# EAGLE board ECUTeen3.5_rev.A_20180306 (EAGLE 7.5.0)
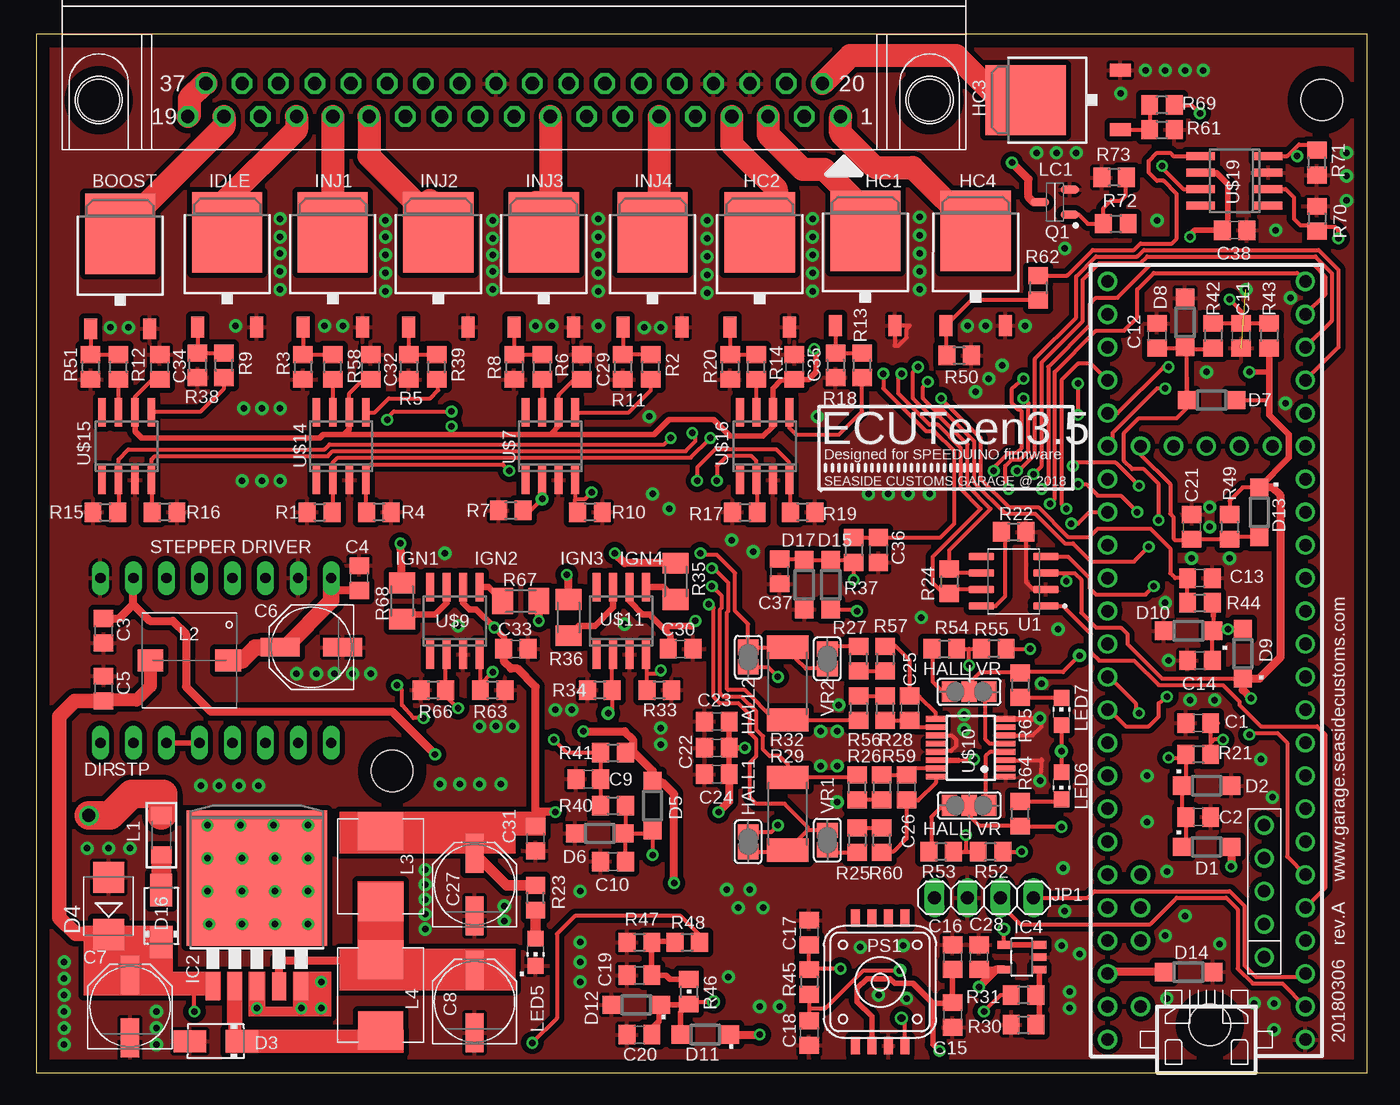
[diagram p2: board, top side]
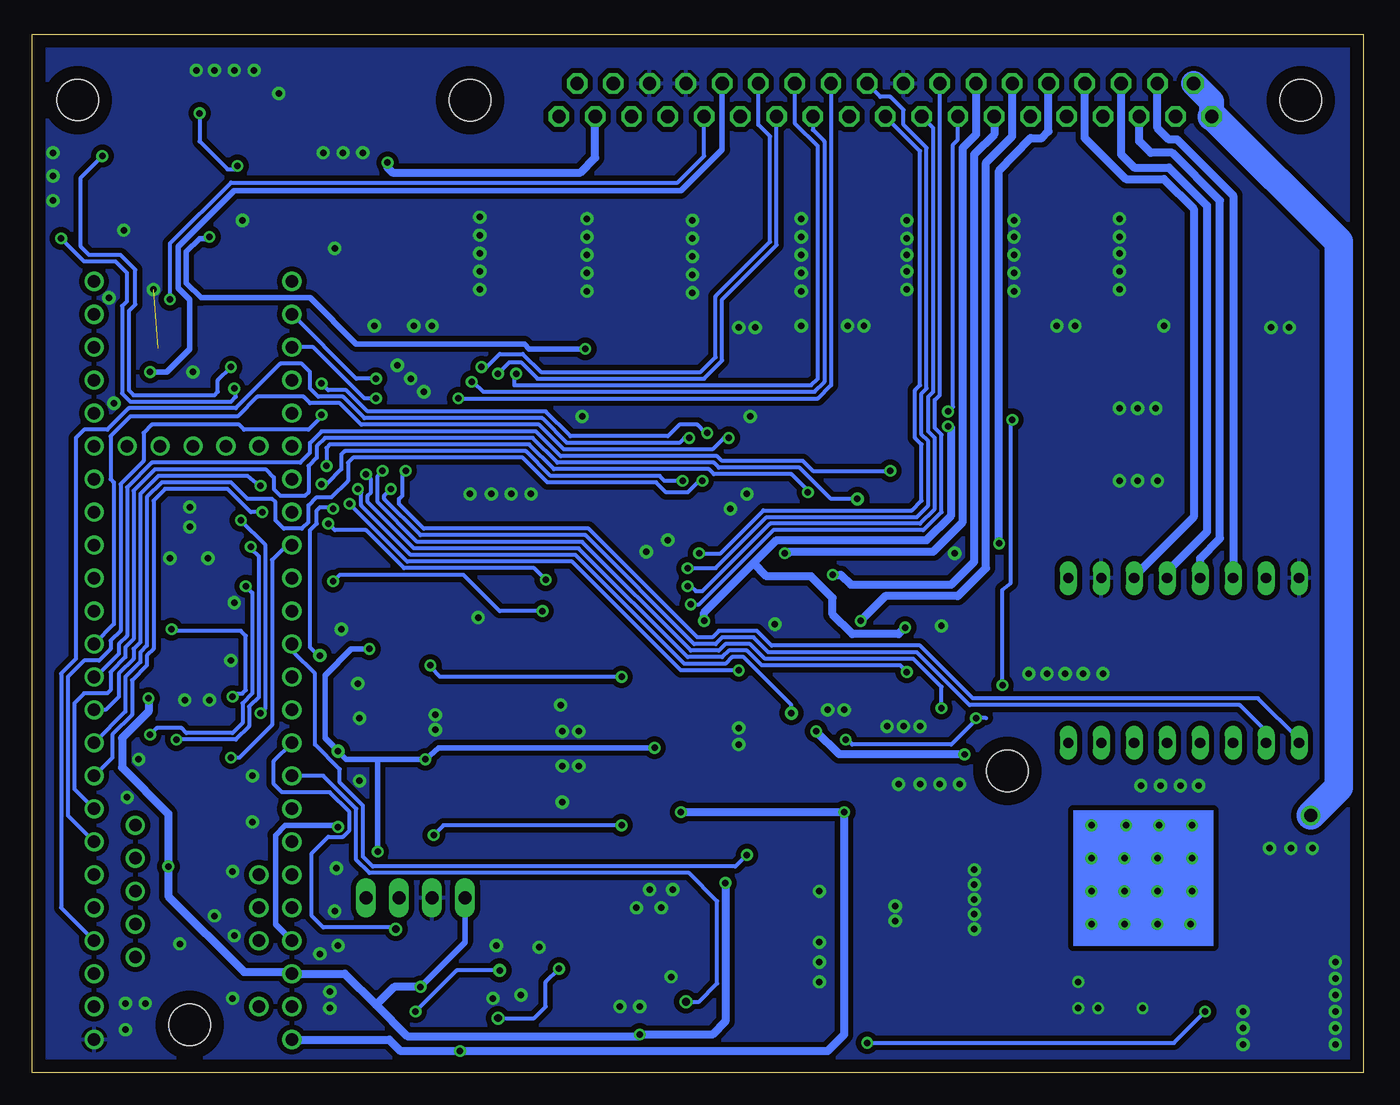
[diagram p3: board, bottom side, seen from below]

Size 102.54 x 80 mm. Coordinates in mm from the lower left corner, seen from the top.
Outline: 0,0 102.54,0 102.54,80 0,80 0,0
Copper layers (1*16): Top 0.035mm / dielectric 1.5mm / Bottom 0.035mm
Design rules "default *": minimum track width 10mil, minimum drill 24mil, track to track 8mil, track to pad 8mil, pad to pad 8mil, via to via 8mil, smd to smd 8mil, copper to edge 40mil, drill to drill 8mil, minimum pad ring 10mil, minimum via ring 8mil, stop-mask expansion 4mil, vias tented up to drill 20mil, thermal gap 10mil
Holes 3.2 mm at 27.43,23.24 90.42,3.68 99.06,74.93

## Footprints (pad centres in the part's own frame; a part is rotated, then mirrored left to right if it is on the bottom)
C0805 = smd 1.3 x 1.5: 1 -0.95,0; 2 0.95,0
PANASONIC_D = smd 3 x 1.4: + 2.4,0; - -2.4,0
D-37M/90 = drill 1.016 pad 1.575 octagon: 1 25.146,-1.27; 2 22.352,-1.27; 3 19.558,-1.27; 4 16.764,-1.27; 5 13.97,-1.27; 6 11.176,-1.27; 7 8.382,-1.27; 8 5.588,-1.27; 9 2.794,-1.27; 10 0,-1.27; 11 -2.794,-1.27; 12 -5.588,-1.27; 13 -8.382,-1.27; 14 -11.176,-1.27; 15 -13.97,-1.27; 16 -16.764,-1.27; 17 -19.558,-1.27; 18 -22.352,-1.27; 19 -25.146,-1.27; 20 23.749,1.27; 21 20.955,1.27; 22 18.161,1.27; 23 15.367,1.27; 24 12.573,1.27; 25 9.779,1.27; 26 6.985,1.27; 27 4.191,1.27; 28 1.397,1.27; 29 -1.397,1.27; 30 -4.191,1.27; 31 -6.985,1.27; 32 -9.779,1.27; 33 -12.573,1.27; 34 -15.367,1.27; 35 -18.161,1.27; 36 -20.955,1.27; 37 -23.749,1.27 | hole 3.2: 32.004,0; -32.004,0
SOD123 = smd 1.4 x 1.4: A 1.9,0; C -1.9,0
DO214AC = smd 2.5 x 1.7: A 2,0; C -2,0
SMB = smd 2.4 x 2.4: A 2.2,0; C -2.2,0
TO263-5 = smd 1.067 x 2.159: 1 -3.404,-5.791; 2 -1.702,-5.791; 3 0,-5.791; 4 1.702,-5.791; 5 3.404,-5.791 | smd 10.8 x 10.41: 6 0,2.54
SOT23-5 = smd 0.6 x 1.05: 1 -0.95,-1.35; 2 0,-1.35; 3 0.95,-1.35; 4 0.95,1.35; 5 -0.95,1.35
SJ_2 = smd 1.168 x 1.6: 1 -1.524,0; 2 0,0; 3 1.524,0
1X04 = drill 1.016 long: 1 -3.81,0; 2 -1.27,0; 3 1.27,0; 4 3.81,0
L1206 = smd 1.3 x 1.6: 1 -1.524,0; 2 1.524,0
WE-PD_7332/7345_PLASTIC_BASE = smd 1.7 x 2: 1 0,3; 2 0,-3
WE-LHMI_7030/7050 = smd 2.95 x 3.5: 1 -2.725,0; 2 2.725,0
CHIP-LED0805 = smd 1.2 x 1.2: A 0,-1.05; C 0,1.05
1317A = smd 1.346 x 0.686: 1 4.915,-1.905; 2 4.915,-0.635; 3 4.915,0.635; 4 4.915,1.905; 5 -4.915,1.905; 6 -4.915,0.635; 7 -4.915,-0.635; 8 -4.915,-1.905
SOT95P280X135-3N = smd 1.4 x 0.65: 1 -1.15,0.95; 2 -1.15,-0.95; 3 1.15,0
R0805 = smd 1.3 x 1.5: 1 -0.95,0; 2 0.95,0
R2512 = smd 1.8 x 3.2: 1 -2.8,0; 2 2.8,0
M1206 = smd 1.6 x 2: 1 -1.4,0; 2 1.4,0
SJ = smd 1.168 x 1.6: 1 -0.762,0; 2 0.762,0
STEP-STICK = drill 0.8 long: 1A -8.89,-7.62; 1B -8.89,-5.08; 2A -8.89,-2.54; 2B -8.89,0; DIR 3.81,-12.7; EN 3.81,5.08; GND -8.89,-12.7; GNDM -8.89,2.54; MS1 3.81,2.54; MS2 3.81,0; MS3 3.81,-2.54; RST 3.81,-5.08; SLP 3.81,-7.62; SPT 3.81,-10.16; VCC -8.89,-10.16; VMOT -8.89,5.08
SOIC127P600X175-8N = smd 1.97 x 0.6: 1 -2.475,1.905; 2 -2.475,0.635; 3 -2.475,-0.635; 4 -2.475,-1.905; 5 2.475,-1.905; 6 2.475,-0.635; 7 2.475,0.635; 8 2.475,1.905
TEENSY_3.5/3.6 = drill 0.965: 0/RX -25.4,-7.62; 1/TX -22.86,-7.62; 2 -20.32,-7.62; 3/CANTX -17.78,-7.62; 3V3 7.62,-7.62; 3V3_2 17.78,-2.54; 3V3_LO -22.86,7.62; 4/CANRX -15.24,-7.62; 5 -12.7,-7.62; 6 -10.16,-7.62; 7 -7.62,-7.62; 8 -5.08,-7.62; 9/CS -2.54,-7.62; 10/CS 0,-7.62; 11/MOSI 2.54,-7.62; 12/MISO 5.08,-7.62; 13/SCK 5.08,7.62; 14/A0 2.54,7.62; 15/A1 0,7.62; 16/A2 -2.54,7.62; 17/A3 -5.08,7.62; 18/A4/SDA -7.62,7.62; 19/A5/SCL -10.16,7.62; 20/A6 -12.7,7.62; 21/A7 -15.24,7.62; 21/DAC0 12.7,7.62; 22/A8 -17.78,7.62; 23/A9 -20.32,7.62; 24 10.16,-7.62; 25 12.7,-7.62; 26 15.24,-7.62; 27 17.78,-7.62; 28 20.32,-7.62; 29 22.86,-7.62; 30 25.4,-7.62; 31/A12 27.94,-7.62; 32/A13 30.48,-7.62; 33/A14 30.48,7.62; 34/A15 27.94,7.62; 35/A16 25.4,7.62; 36/A17 22.86,7.62; 37/A18 20.32,7.62; 38/A19 17.78,7.62; 39/A20 15.24,7.62; A10 -17.78,5.08; A11 -15.24,5.08; A22/DAC1 10.16,7.62; AGND -25.4,7.62; AREF -20.32,5.08; GND -27.94,-7.62; GND2 7.62,7.62; GND3 17.78,0; PROG 17.78,2.54; RESET 17.78,5.08; U5V -21.59,-4.445; UD+ -16.51,-4.445; UD- -19.05,-4.445; UGND1 -13.97,-4.445; UGND2 -11.43,-4.445; VBAT 17.78,-5.08; VIN -27.94,7.62; VUSB -25.4,5.08
DPAK_N-CHANNEL_MOSFET = smd 5.4 x 6.2: D 0,1.23 | smd 1 x 1.6: G -2.28,-6.07; S 2.28,-6.07
SO-8 = smd 0.6 x 2.2: 1 -1.905,-2.6; 2 -0.635,-2.6; 3 0.635,-2.6; 4 1.905,-2.6; 5 1.905,2.6; 6 0.635,2.6; 7 -0.635,2.6; 8 -1.905,2.6
QSOP16 = smd 0.45 x 1.5: 1 -2.223,-2.69; 2 -1.587,-2.69; 3 -0.953,-2.69; 4 -0.318,-2.69; 5 0.318,-2.69; 6 0.953,-2.69; 7 1.587,-2.69; 8 2.223,-2.69; 9 2.223,2.69; 10 1.587,2.69; 11 0.953,2.69; 12 0.318,2.69; 13 -0.318,2.69; 14 -0.953,2.69; 15 -1.587,2.69; 16 -2.223,2.69

## Placement (x,y rotation side)
C1  100nF  [C0805]  89.53,26.92 180 top
C2  220nF  [C0805]  89.53,19.68 0 top
C3  100nF  [C0805]  5.21,34.04 270 top
C4  100nF 50V  [C0805]  24.89,38.1 90 top
C5  100nF 50V  [C0805]  5.21,29.59 90 top
C6  100uF 35V  [PANASONIC_D]  21.21,32.77 180 top
C7  470uF 50V  [PANASONIC_D]  7.24,5.08 90 top
C8  220uF 15V  [PANASONIC_D]  33.78,5.46 90 top
C9  100nF  [C0805]  42.55,22.61 180 top
C10  220nF  [C0805]  44.45,16.26 180 top
C11  100nF  [C0805]  92.84,56.77 270 top
C12  220nF  [C0805]  86.36,56.77 90 top
C13  100nF  [C0805]  89.66,38.1 0 top
C14  220nF  [C0805]  89.66,31.75 180 top
C15  1uF  [C0805]  70.61,4.45 270 top
C16  100nF  [C0805]  70.61,8.89 90 top
C17  100nF  [C0805]  59.56,10.79 270 top
C18  220nF  [C0805]  59.56,3.05 90 top
C19  100nF  [C0805]  46.48,7.49 180 top
C20  220nF  [C0805]  46.48,2.92 180 top
C21  4.7nF  [C0805]  89.03,42.04 90 top
C22  10nF  [C0805]  52.45,25.02 180 top
C23  100nF  [C0805]  52.45,27.05 180 top
C24  1uF  [C0805]  52.45,22.99 180 top
C25  1nF  [C0805]  67.31,28.07 90 top
C26  1nF  [C0805]  67.06,21.97 90 top
C27  220uF  [PANASONIC_D]  33.78,14.48 90 top
C28  100nF  [C0805]  72.64,8.89 270 top
C29  1uF  [C0805]  42.04,54.36 270 top
C30  1uF  [C0805]  49.66,32.64 180 top
C31  1uF  [C0805]  38.48,18.03 270 top
C32  1uF  [C0805]  25.78,54.36 270 top
C33  1uF  [C0805]  36.96,32.64 180 top
C34  1uF  [C0805]  9.53,54.36 270 top
C35  1uF  [C0805]  58.42,54.36 270 top
C36  100nF  [C0805]  64.9,40.26 270 top
C37  220nF  [C0805]  57.28,38.61 270 top
C38  1uF  [C0805]  92.33,64.9 180 top
CON1  [D-37M/90]  36.83,74.93 0 top
D1  1N5819HW-7-F  [SOD123]  90.17,17.4 180 top
D2  1N5819HW-7-F  [SOD123]  90.17,22.1 0 top
D3  B340A 3A  [DO214AC]  13.84,2.41 180 top
D4  1SMB5937BT3G  [SMB]  5.59,12.83 90 top
D5  1N5819HW-7-F  [SOD123]  47.5,20.57 270 top
D6  1N5819HW-7-F  [SOD123]  43.43,18.41 180 top
D7  1N5819HW-7-F  [SOD123]  90.55,51.82 180 top
D8  1N5819HW-7-F  [SOD123]  88.52,57.78 90 top
D9  1N5819HW-7-F  [SOD123]  92.96,32.26 90 top
D10  1N5819HW-7-F  [SOD123]  88.77,34.04 180 top
D11  1N5819  [SOD123]  51.56,2.92 180 top
D12  1N5819  [SOD123]  46.23,5.21 180 top
D13  1N5819HW-7-F  [SOD123]  94.23,43.18 270 top
D14  BZT52C3V6  [SOD123]  88.77,7.75 0 top
D15  1N5819HW-7-F  [SOD123]  61.21,37.59 90 top
D16  B340A 3A  [DO214AC]  9.65,12.06 90 top
D17  1N5819HW-7-F  [SOD123]  59.18,37.59 270 top
IC2  LM2596S  [TO263-5]  17.02,12.45 0 top
IC4  LMV321_SOT23-5DBV  [SOT23-5]  75.95,8.89 90 top
JMP1  [SJ_2]  71.88,20.57 180 top
JMP2  [SJ_2]  71.88,29.34 0 top
JP1  [1X04]  73.03,13.46 0 top
L1  600R 2A  [L1206]  9.65,18.29 90 top
L2  8.2uH 2.7A  [WE-PD_7332/7345_PLASTIC_BASE]  11.81,31.75 270 top
L3  33uH  [WE-LHMI_7030/7050]  26.54,15.88 90 top
L4  33uH  [WE-LHMI_7030/7050]  26.54,5.97 90 top
LED5  [CHIP-LED0805]  38.48,9.27 180 top
LED6  [CHIP-LED0805]  78.99,22.1 180 top
LED7  [CHIP-LED0805]  78.99,27.81 0 top
PS1  MPXH6400AC6T1  [1317A]  65.02,6.99 270 top
Q1  IRLML0030TRPBF  [SOT95P280X135-3N]  78.49,67.06 180 top
R1  100K  [R0805]  21.84,43.18 0 top
R2  22R  [R0805]  47.37,54.36 90 top
R3  68K  [R0805]  20.57,54.36 270 top
R4  100K  [R0805]  26.42,43.18 180 top
R5  68K  [R0805]  28.7,54.36 270 top
R6  22R  [R0805]  38.99,54.36 90 top
R7  100K  [R0805]  36.58,43.31 0 top
R8  68K  [R0805]  36.83,54.36 270 top
R9  22R  [R0805]  14.48,54.48 90 top
R10  100K  [R0805]  42.67,43.18 180 top
R11  68K  [R0805]  45.21,54.36 270 top
R12  22R  [R0805]  6.35,54.36 90 top
R13  22R  [R0805]  63.63,54.48 90 top
R14  22R  [R0805]  55.5,54.36 90 top
R15  100K  [R0805]  5.33,43.18 0 top
R16  100K  [R0805]  9.91,43.18 180 top
R17  100K  [R0805]  54.61,43.18 0 top
R18  68K  [R0805]  61.59,54.48 270 top
R19  100K  [R0805]  59.05,43.18 180 top
R20  68K  [R0805]  53.47,54.36 270 top
R21  470R  [R0805]  89.53,24.51 180 top
R22  10K  [R0805]  75.31,41.66 0 top
R23  1K  [R0805]  38.48,13.46 90 top
R24  120R  [R0805]  70.36,37.85 270 top
R25  5K  [R0805]  63.25,17.91 270 top
R26  5K  [R0805]  63.25,21.97 90 top
R27  5K  [R0805]  63.37,31.88 90 top
R28  5K  [R0805]  65.41,28.07 90 top
R29  4K7 3W  [R2512]  57.91,19.94 90 top
R30  330K 0.1%  [R0805]  76.07,3.68 0 top
R31  180K 0.1%  [R0805]  76.07,5.97 180 top
R32  4K7 3W  [R2512]  57.91,29.97 90 top
R33  100K  [R0805]  48.01,29.46 180 top
R34  100K  [R0805]  43.43,29.46 180 top
R35  22R  [M1206]  49.28,37.85 90 top
R36  22R  [M1206]  41.02,35.05 90 top
R37  470R  [R0805]  62.99,40.26 270 top
R38  68K  [R0805]  12.45,54.48 270 top
R39  22R  [R0805]  30.86,54.36 90 top
R40  470R  [R0805]  44.45,20.57 0 top
R41  2K49  [R0805]  44.45,24.64 0 top
R42  470R  [R0805]  90.68,56.77 270 top
R43  2K49  [R0805]  95,56.77 270 top
R44  470R  [R0805]  89.66,36.2 0 top
R45  470R  [R0805]  59.56,6.99 270 top
R46  470R  [R0805]  50.29,6.22 270 top
R47  1K  [R0805]  46.48,10.03 0 top
R48  3K9  [R0805]  50.16,10.03 0 top
R49  1K  [R0805]  91.95,42.04 270 top
R50  68K  [R0805]  71.12,55.24 0 top
R51  68K  [R0805]  4.19,54.36 270 top
R52  10K  [R0805]  73.53,17.02 180 top
R53  1K  [R0805]  69.72,17.02 180 top
R54  1K  [R0805]  69.98,32.64 0 top
R55  10K  [R0805]  73.79,32.64 180 top
R56  5K  [R0805]  63.37,28.07 270 top
R57  5K  [R0805]  65.41,31.88 270 top
R58  22R  [R0805]  22.86,54.36 90 top
R59  5K  [R0805]  65.15,21.97 270 top
R60  5K  [R0805]  65.15,17.91 90 top
R61  68K  [R0805]  86.74,72.64 0 top
R62  22R  [R0805]  77.22,60.45 270 top
R63  100K  [R0805]  35.18,29.46 180 top
R64  10K  [R0805]  75.82,19.94 90 top
R65  10K  [R0805]  75.82,29.84 270 top
R66  100K  [R0805]  30.61,29.46 180 top
R67  22R  [M1206]  37.34,36.32 0 top
R68  22R  [M1206]  28.19,36.32 90 top
R69  22R  [R0805]  86.74,74.55 180 top
R70  100K  [R0805]  98.68,65.79 270 top
R71  100K  [R0805]  98.68,70.1 90 top
R72  100R  [R0805]  83.19,65.41 0 top
R73  10K  [R0805]  83.06,68.96 180 top
SJ3  VR2  [SJ]  60.96,31.88 90 top
SJ4  VR1  [SJ]  60.96,17.91 270 top
SJ5  HALL2  [SJ]  54.86,32 270 top
SJ6  HALL1  [SJ]  54.86,17.78 90 top
STEPSTICK-X  STEP-STICK  [STEP-STICK]  17.65,29.21 270 top
U1  SN65HVD230QDR  [SOIC127P600X175-8N]  75.31,37.85 180 top
U$1  TEENSY_3.5/3.6  [TEENSY_3.5/3.6]  90.17,30.48 90 top
U$2  DPAK_N-CHANNEL_MOSFET  [DPAK_N-CHANNEL_MOSFET]  55.75,63.5 0 top
U$3  DPAK_N-CHANNEL_MOSFET  [DPAK_N-CHANNEL_MOSFET]  63.88,63.63 0 top
U$4  DPAK_N-CHANNEL_MOSFET  [DPAK_N-CHANNEL_MOSFET]  30.99,63.5 0 top
U$5  DPAK_N-CHANNEL_MOSFET  [DPAK_N-CHANNEL_MOSFET]  14.73,63.5 0 top
U$6  DPAK_N-CHANNEL_MOSFET  [DPAK_N-CHANNEL_MOSFET]  39.12,63.5 0 top
U$7  TC427SO-8  [SO-8]  39.62,48.26 0 top
U$8  DPAK_N-CHANNEL_MOSFET  [DPAK_N-CHANNEL_MOSFET]  47.5,63.5 0 top
U$9  TC427SO-8  [SO-8]  32.26,34.8 0 top
U$10  MAX9926  [QSOP16]  72.01,25.02 90 top
U$11  TC427SO-8  [SO-8]  45.09,34.8 0 top
U$12  DPAK_N-CHANNEL_MOSFET  [DPAK_N-CHANNEL_MOSFET]  22.86,63.5 0 top
U$13  DPAK_N-CHANNEL_MOSFET  [DPAK_N-CHANNEL_MOSFET]  6.48,63.37 0 top
U$14  TC427SO-8  [SO-8]  23.5,48.26 0 top
U$15  TC427SO-8  [SO-8]  6.99,48.26 0 top
U$16  TC427SO-8  [SO-8]  56.13,48.26 0 top
U$17  DPAK_N-CHANNEL_MOSFET  [DPAK_N-CHANNEL_MOSFET]  77.47,74.93 90 top
U$18  DPAK_N-CHANNEL_MOSFET  [DPAK_N-CHANNEL_MOSFET]  72.39,63.63 0 top
U$19  TC427SO-8  [SO-8]  92.33,68.71 90 top

## Tracks (layer width: path | path; a pad name or v marks a point on that pad's centre or on a via)
+3V3  (via drill 0.5)
  Top 0.305: D13.C 92.96,45.08 91.95,44.07 R49.1 | R43.2 95,55.12 | D7.C 94.87,51.82 95,51.94 | U1.3 79.12,38.48 | 79.12,38.48 80.01,38.48 80.52,37.97 80.52,35.43 81.66,34.29 83.57,34.29 84.07,33.78 84.07,33.02 86.74,30.35 D9.C | D15.C 63.11,35.69 v63.25,35.56 | v79.38,37.85 79.38,38.23 79.12,38.48
  Top 0.406: IC4.5 C28.2 | v93.47,53.98 95,53.98 95,53.72
  Top 0.508: R43.2 95,53.72 95,51.94 95,50.67 96.52,49.15 96.52,47.37 D13.C
  Top 0.61: C3.1 6.41,34.99 7.49,36.07 | 7.49,36.07 STEPSTICK-X.VCC | D11.C v55.75,2.92 | IC4.5 73.98,7.94 v72.64,6.6 | D14.C 82.68,7.75 U$1.3V3_LO | D13.C 95.25,45.09 95.89,44.45 95.89,32 94.24,30.36 D9.C 92.96,29.46 v93.6,28.83 | R41.2 46.1,24.64 | 46.1,24.64 47.5,23.24 D5.C 47.62,22.35 48.26,22.35 49.15,21.46 v49.15,14.61 | 7.49,36.07 8.76,34.8 10.54,34.8 11.56,33.78 11.56,29.72 13.46,27.81 27.43,27.81 v30.73,24.51 | v42.16,26.29 45.34,26.29 45.97,25.65 45.97,24.77 46.1,24.64 | D1.C v92.07,15.88 v92.08,15.88
  Bottom 0.305: v63.25,35.56 66.55,35.56 69.34,38.35 78.87,38.35 v79.38,37.85
  Bottom 0.406: v93.47,53.98 92.2,53.98 90.42,55.75 90.42,59.56 91.31,60.45 91.31,63.63 87,67.94 52.58,67.94 49.4,71.12 CON1.24 | JP1.1 69.22,10.03 v72.64,6.6
  Bottom 0.61: 76.07,5.21 78.49,7.62 U$1.3V3_LO 82.68,7.75 86.23,7.75 92.08,13.59 v92.08,15.88 92.08,19.94 95.63,23.5 95.63,25.78 93.6,27.81 v93.6,28.83 | 76.07,5.21 73.66,2.79 55.88,2.79 v55.75,2.92 50.16,2.92 49.15,3.94 v49.15,14.61 | v72.64,6.6 74.68,6.6 76.07,5.21 | v30.73,24.51 40.39,24.51 v42.16,26.29
+5V  (via drill 0.5, 0.5 pad 1.02)
  Top 0.305: U$7.6 40.26,52.2 41.4,53.34 41.97,53.34 C29.2 | U$15.6 7.62,52.07 8.89,53.34 9.46,53.34 C34.2 | U$14.6 24.13,52.32 25.02,53.21 25.59,53.21 C32.2 | 71.06,24.07 v72.26,24.13 | R55.1 v76.58,32.64 | R52.1 v75.95,17.02 | 70.55,5.33 C15.1 | LED7.A v78.99,24.77 LED6.A
  Top 0.406: 31.75,19.16 30.98,19.16 30.98,18.6 | U$10.14 71.06,24.07 | C24.1 C22.1 | C22.1 C23.1 | 69.08,5.33 70.55,5.33 | C16.1 C15.1 | 69.08,5.33 69.08,2.17 v69.6,1.65 | U$15.6 7.62,49.4 8.13,48.9 21.84,48.9 22.1,49.15 23.75,49.15 | 23.75,49.15 24.13,49.53 U$14.6 | 23.75,49.15 32,49.15 | 32,49.15 39.62,49.15 | 39.62,49.15 40.39,49.91 40.39,50.73 U$7.6 | 39.62,49.15 47.62,49.15 48.77,50.29 52.2,50.29 53.47,49.02 56.01,49.02 56.77,49.78 U$16.6 56.77,52.7 57.4,53.34 58.35,53.34 C35.2 59.5,53.41 60.07,53.98 60.07,55.63 v59.94,55.75 | C22.1 v54.61,25.02 | PS1.2 64.39,4.32 63.25,5.46 63.25,6.48 64.01,7.24 65.79,7.24 66.17,6.86 67.56,6.86 69.08,5.33 | v32,49.78 32,49.15 | U$19.6 90.93,69.34 91.82,68.45 91.82,65.34 C38.2 89.28,64.9 88.9,64.52 v88.9,64.39
  Top 0.508: 48.9,32.83 48.9,33.66 48.45,34.1 | 36.07,32.7 36.07,33.53 v35.31,34.29 33.91,35.69 33.4,35.69 32.89,36.2 U$9.6 | U$11.6 45.72,36.32 46.74,35.31 47.24,35.31 48.45,34.1 | 50.42,34.42 48.77,34.42 48.45,34.1
  Top 0.61: L3.2 30.98,18.6 | 31.75,19.16 32.37,18.47 | 32.37,18.47 C27.+ | 48.9,32.83 C30.2 | 36.07,32.7 C33.2 36.07,32.58 36.07,31.62 36.58,31.11 37.08,31.11 38.48,29.72 38.48,20.32 | 38.48,20.32 C31.1 32.88,18.98 32.37,18.47 | C24.1 53.4,20.89 v52.58,20.07 | v40.01,20.07 38.73,20.07 38.48,20.32 | 50.42,34.42 v50.8,34.8
  Top 0.813: R23.2 36.25,14.41 C27.+
  Bottom 0.305: 75.95,24 76.07,24.13
  Bottom 0.406: v75.95,17.02 75.95,24 | v54.61,25.02 71.25,25.02 v72.26,24.13 76.07,24.13 78.36,24.13 v78.99,24.77 80.01,25.78 80.01,30.61 77.98,32.64 v76.58,32.64 | v59.94,55.75 64.26,55.75 64.64,56.13 77.6,56.13 81.15,59.69 89.53,59.69 90.68,60.83 90.68,63.25 89.66,64.26 89.03,64.26 v88.9,64.39
  Bottom 0.61: v52.58,20.07 v40.01,20.07 40.01,2.92 41.27,1.65 v69.6,1.65 74.17,1.65 75.06,2.54 U$1.VIN | 46.99,39.24 50.8,35.43 v50.8,34.8 50.67,34.67 | 46.99,39.24 45.21,41.02 33.66,41.02 31.75,42.93 31.75,49.66 31.88,49.66 v32,49.78 | v35.31,34.29 35.81,33.78 39.37,33.78 40.89,35.31 40.89,36.58 42.55,38.23 45.97,38.23 46.99,39.24
+12V_ECU  (via drill 0.5)
  Top 0.305: IC2.1 12.06,6.66 | 12.06,6.66 10.41,6.66 | D4.C 7.24,8.98 C7.+ | R48.2 51.12,10.61 49.66,12.06 41.53,12.06 40.13,10.67 40.13,4.19 v38.23,2.29 | v12.19,4.7 12.19,6.53 12.06,6.66
  Top 1.016: L2.2 8.81,29.77 7.75,28.7 5.27,28.7 C5.1
  Top 1.118: C5.1 2.99,28.64 1.78,27.43 1.78,11.94 3.05,10.67 5.55,10.67 D4.C
  Top 1.27: C7.+ 7.24,6.66 10.41,6.66 9.65,7.42 D16.C
  Bottom 0.305: v38.23,2.29 14.61,2.29 v12.19,4.7
BOOST
  Top 1.676: 6.6,64.73 U$13.D
  Top 1.778: CON1.18 14.48,72.9 6.73,65.15 6.73,64.86 U$13.D
BOOST_CPU  (via drill 0.5)
  Top 0.305: R15.2 6.35,43.25 U$15.2 6.35,47.24 7.11,48.01 22.23,48.01 22.61,48.39 48.39,48.39 v48.9,48.9
  Bottom 0.305: U$1.11/MOSI 96.27,34.54 96.27,45.47 96.52,45.72 96.52,49.02 95,50.55 86.74,50.55 85.22,52.07 81.66,52.07 81.15,51.56 78.87,51.56 77.22,49.91 63.5,49.91 61.59,48.01 50.16,48.01 49.28,48.9 v48.9,48.9
BOOST_TC4
  Top 0.305: U$13.G R51.1 R12.2
BRV_CPU  (via drill 0.6)
  Top 0.305: 50.29,5.46 v52.2,5.46
  Top 0.406: R46.2 50.23,5.21 D12.C 48.01,5.08 48.01,3.94 47.43,3.36 C20.1 47.5,2.85 | R46.2 50.29,5.46 | D11.A 49.66,4.64 R46.2
  Bottom 0.305: v52.2,5.46 51.18,5.46 49.78,6.86 49.78,13.21 51.94,15.37 76.58,15.37 77.6,16.38 77.6,20.32 80.14,22.86 U$1.18/A4/SDA
CAM_CPU  (via drill 0.5, 0.5 pad 1.02)
  Top 0.305: JMP2.2 71.88,29.97 72.77,30.86 75.75,30.86 R65.1 75.89,30.86 79.12,30.86 v80.39,32.13 | U$1.36/A17 81.28,54.61 80.26,54.61 78.99,53.34 78.99,43.81 v79.38,43.43
  Bottom 0.305: v80.39,32.13 80.52,32.13 81.15,32.77 81.15,41.78 80.64,42.29 80.64,43.31 80.39,43.56 79.5,43.56 v79.38,43.43
CAN_H  (via drill 0.5)
  Top 0.305: U1.7 70.67,37.21 | 70.67,37.21 R24.2 | 70.67,37.21 69.6,37.21 69.09,37.72 69.09,39.75 72.77,43.43 71.25,44.96 71.25,48.13 69.47,49.91 68.83,49.91 66.42,52.32 66.42,53.59 v66.67,53.85
  Bottom 0.305: v66.67,53.85 65.79,54.74 64.9,54.74 63.63,53.47 50.8,53.47 49.4,54.86 49.4,59.56 45.21,63.75 CON1.7
CAN_L  (via drill 0.5)
  Top 0.305: U1.6 70.67,38.48 R24.1 70.36,40.26 73.53,43.43 71.75,45.21 71.75,48.39 69.6,50.55 68.96,50.55 67.56,51.94 67.56,53.98 v67.94,54.36
  Bottom 0.305: v67.94,54.36 67.56,54.36 66.55,55.37 64.77,55.37 63.37,53.98 51.05,53.98 49.91,55.12 49.91,59.82 45.72,64.01 45.72,72.14 46.61,73.03 CON1.25
CANRX  (via drill 0.5)
  Top 0.305: U1.4 79.5,39.75 81.15,38.1 81.15,37.34 81.66,36.83 85.47,36.83 v86.11,37.47 | v93.47,26.04 93.6,26.04 93.73,26.16 95.63,26.16 96.39,25.4 96.39,16.64 U$1.4/CANRX
  Bottom 0.305: v86.11,37.47 85.6,36.96 85.6,29.21 86.36,28.45 86.36,26.92 87.12,26.16 90.68,26.16 91.06,26.54 92.96,26.54 v93.47,26.04
CANTX
  Top 0.305: U1.1 79.12,35.94 81.28,33.78 81.28,32.38 81.92,31.75 84.58,31.75 86.49,29.84 91.44,29.84 92.71,28.57 92.71,28.32 94.36,26.67 98.68,26.67 99.31,26.04 99.31,14.22 U$1.3/CANTX
CLT_CPU  (via drill 0.5)
  Top 0.305: C12.1 88.45,55.82 D8.C 88.65,55.75 | 88.65,55.75 D7.A 88.65,53.59 88.65,51.18 87.88,50.42 84.96,50.42 83.82,49.28 83.82,47.12 84.45,46.48 85.34,46.48 86.49,45.34 v86.49,42.55 | 88.65,55.75 90.61,55.75 R42.2 | U$1.15/A1 82.68,30.48 84.71,28.45 84.71,27.94 v84.96,27.69
  Bottom 0.305: v86.49,42.55 84.58,40.64 84.58,28.07 v84.96,27.69
COOLANT_SENSOR  (via drill 0.5)
  Top 0.305: R43.1 C11.1 | C11.1 R42.1 | C11.1 92.84,58.67 v91.95,59.56
  Bottom 0.305: 91.82,59.69 v91.95,59.56 91.95,63.88 87.25,68.58 52.83,68.58 50.8,70.61 CON1.5
CRANK_CPU  (via drill 0.5)
  Top 0.305: JMP1.2 71.88,19.81 72.64,19.05 75.76,19.05 R64.1 75.89,18.92 v78.99,18.92
  Bottom 0.406: v78.99,18.92 79.12,18.92 79.25,19.05 83.06,19.05 83.82,18.29 83.82,11.43 U$1.23/A9
DIR  (via drill 0.5)
  Top 0.305: v73.79,46.35 73.79,46.61 74.93,47.75 75.56,47.75 75.95,48.13 75.95,50.93 75.82,51.05 75.69,51.05 75.18,51.56 75.18,52.7 v76.07,53.47
  Bottom 0.305: STEPSTICK-X.DIR 4.95,25.65 8.13,28.83 30.1,28.83 34.16,32.89 45.59,32.89 46.74,34.04 49.66,34.04 50.16,33.53 51.31,33.53 59.69,41.91 72.39,41.91 74.3,43.81 74.3,44.2 74.04,44.45 74.04,46.1 v73.79,46.35 | v76.07,53.47 77.6,53.47 U$1.34/A15
GND  (via drill 0.5 pad 0.61, 0.5 pad 1.02)  (1 unrouted)
  Top 0.305: v17.02,4.95 v20.45,4.95 v21.97,4.95 v21.97,6.99 | U$10.11 70.55,25.97 70.87,25.65 70.87,25.15 70.48,24.77 69.38,24.77 U$10.13 | U$10.6 76.77,25.97 77.47,26.67 v77.34,27.3 | U$10.3 77.41,24.07 77.47,24.13 v77.34,22.48 | R22.2 76.26,37.78 76.83,37.21 U1.2 | U$3.S 66.16,56.01 66.17,56.01 66.42,56.01 67.06,56.64 67.06,57.28 67.31,57.53 66.17,57.53 66.17,57.28 66.04,57.15
  Top 0.406: U$10.8 76.77,27.24 v77.34,27.3
  Top 0.813: IC2.5 20.42,4.98 v20.45,4.95 | IC2.3 v17.02,4.95
  other vias: 51.69,65.66 51.69,64.26 51.69,62.87 51.69,61.47 51.69,60.07 59.82,65.79 59.82,64.39 59.82,62.99 59.82,61.59 59.82,60.2 43.31,65.79 43.31,64.39 43.31,62.99 43.31,61.59 43.31,60.2 35.18,65.66 35.18,64.26 35.18,62.99 35.18,61.72 35.18,60.33 26.92,65.66 26.92,64.39 26.92,62.99 26.92,61.59 26.92,60.2 18.8,65.79 18.8,64.39 18.8,63.12 18.8,61.72 18.8,60.33 5.71,57.4 7.11,57.4 15.37,57.53 22.23,57.53 23.62,57.53 38.48,57.53 39.75,57.53 43.31,57.53 46.86,57.4 48.13,57.4 68.07,65.91 68.07,64.52 68.07,63.12 68.07,61.72 68.07,60.33 96.65,59.69 96.27,51.56 90.17,53.98 90.42,43.56 90.42,42.04 91.95,39.62 89.03,39.62 87,36.2 85.6,22.86 85.6,19.3 94.36,24.13 95.25,21.21 88.52,12.06 87.12,15.49 87,10.54 87.12,5.71 93.85,5.33 91.19,9.91 71.5,27.56 61.72,26.29 60.45,26.29 61.72,23.62 60.45,23.62 61.85,28.32 61.72,20.83 77.47,29.97 71.5,26.42 80.39,9.14 78.99,9.78 56.01,12.7 79.63,6.22 79.63,4.95 64.9,5.97 66.8,9.78 63.5,9.65 67.06,5.71 55.75,5.08 79.12,15.75 57.28,5.08 54.99,14.1 53.21,14.1 54.1,12.7 53.34,7.37 41.91,10.03 41.91,8.51 41.91,6.99 41.91,13.97 35.81,22.23 34.16,22.23 32.64,22.23 31.11,22.23 2.16,2.16 2.16,3.43 2.16,4.7 2.16,5.97 2.16,7.24 2.16,8.51 9.27,4.7 9.27,3.43 9.27,2.16 5.59,17.27 3.94,17.27 7.24,17.27 14.1,22.1 12.7,22.1 15.62,22.1 17.14,22.1 48.13,26.54 48.13,25.27 40.01,27.94 41.27,27.94 36.7,26.67 35.43,26.67 34.16,26.67 25.78,30.73 24.38,30.73 22.99,30.73 21.59,30.73 20.07,30.73 18.8,51.18 17.4,51.18 16,51.18 18.8,45.59 17.4,45.59 15.88,45.59 36.07,12.83 36.07,11.68 29.97,15.62 29.97,14.48 29.97,13.34 29.97,12.19 29.97,11.05 31.5,40.01 64.14,44.58 68.83,44.58 67.18,44.58 65.66,44.58 55.24,40.13 48.77,43.43 47.5,44.58 47.24,50.55 95.38,5.33 95.38,3.3 32.51,34.42 45.34,34.54 87.25,31.75 90.81,28.7 88.9,28.7 68.2,35.05 78.74,34.16 53.59,41.02 74.42,54.48 73.41,53.47 72.39,52.45 76.2,57.53 73.15,57.53 100.97,67.18 100.97,69.09 100.97,70.87 79.25,63.5 77.09,70.87 78.61,70.87 80.14,70.87 60.2,50.55 83.57,75.44 85.47,77.22 87,77.22 88.52,77.22 89.92,77.22 79.25,12.45 95.5,64.9 93.22,60.33 71.75,57.53 86.36,65.66
  pour Top (isolate 0.406): -1.52,80.14 102.87,80.01 102.87,0 -1.52,0.13
  pour Bottom (isolate 0.406): -1.27,81.28 104.14,81.28 104.14,-1.27 -1.27,-1.27
HC1
  Top 1.778: CON1.3 56.39,72.26 59.05,69.6 60.71,69.6 62.87,67.44 62.87,65.87 U$3.D
HC1_CPU  (via drill 0.5)
  Top 0.305: v50.93,45.59 50.93,46.61 52.32,48.01 57.02,48.01 58.04,46.99 U$16.4 58.1,45.59 R19.2
  Bottom 0.305: v50.93,45.59 51.18,45.59 52.07,44.7 53.72,44.7 54.48,45.47 62.87,45.47 64.77,47.37 77.85,47.37 78.23,46.99 78.23,45.59 79.5,44.32 80.64,44.32 81.28,43.69 81.28,42.42 81.79,41.91 83.19,41.91 83.82,42.55 83.82,43.94 84.07,44.2 85.98,44.2 87.25,45.47 92.58,45.47 93.73,44.32 93.73,32.89 94.23,32.38 94.23,31.62 95.38,30.48 95.38,27.81 U$1.8
HC1_TC4
  Top 0.305: U$3.G R18.1 R13.2
HC2
  Top 1.778: CON1.4 53.59,71.5 57.02,68.07 57.02,66 U$2.D
HC2_CPU  (via drill 0.5)
  Top 0.305: v52.45,45.59 52.45,46.74 53.21,47.5 55.12,47.5 55.5,47.12 U$16.2 55.56,45.6 R17.2 | v80.26,45.34 80.9,45.34 81.79,44.45 83.57,44.45 v84.84,43.18 84.71,43.05
  Bottom 0.305: v52.45,45.59 53.85,45.59 54.23,45.97 62.61,45.97 64.52,47.88 78.49,47.88 78.74,47.62 78.74,46.48 79.88,45.34 v80.26,45.34 | v84.84,43.18 85.72,43.18 87.5,44.96 92.33,44.96 93.22,44.07 93.22,32.64 93.73,32.13 93.73,31.37 94.87,30.23 94.87,27.56 96.39,26.04 96.39,24.26 U$1.7
HC2_TC4
  Top 0.305: U$2.G R20.1 R14.2
HC3
  Top 1.778: U$17.D 74.3,74.93 70.87,78.36 62.74,78.36 CON1.20
HC3_CPU  (via drill 0.5)
  Top 0.305: v87,52.7 86.36,52.7 82.93,49.28 82.93,48.64 U$1.38/A19 | v100.33,64.26 100.33,64.9 100.08,65.15 98.75,65.15 R70.2 98.11,65.28 97.41,65.28 96.9,65.79 96.9,67.44 96.27,68.07 U$19.2
  Bottom 0.305: v87,52.7 86.87,52.58 86.87,52.07 87.25,51.69 95,51.69 95.63,52.32 95.63,59.05 95.25,59.44 95.25,61.59 96.14,62.48 98.55,62.48 v100.33,64.26
HC3_TC4
  Top 0.305: U$17.G R61.1 R69.2
HC4
  Top 1.778: 72.39,65.02 U$18.D 67.52,69.72 64.64,69.72 61.98,72.39 CON1.1
HC4_CPU  (via drill 0.5)
  Top 0.305: v87.25,54.36 86.87,54.36 83.31,50.8 U$1.37/A18 | R71.2 98.11,71.5 97.28,71.5 96.71,70.93 | U$19.4 96.39,70.61 96.71,70.93 | v97.16,70.61 97.03,70.61 96.71,70.93
  Bottom 0.305: v87.25,54.36 88.27,53.34 88.27,52.45 88.52,52.2 94.74,52.2 95.12,52.58 95.12,58.67 94.61,59.18 94.61,61.85 95.76,62.99 98.17,62.99 98.81,63.63 98.81,68.96 v97.16,70.61
HC4_TC4
  Top 0.305: R50.1 70.11,55.3 U$18.G 72.06,59.5 R62.2
IAT_CPU  (via drill 0.5)
  Top 0.305: R40.2 45.4,18.48 D6.C | C10.1 45.4,18.35 D6.C | D6.C 47.24,18.41 D5.A v47.5,16.76
  Bottom 0.305: v47.5,16.76 48.39,15.88 76.33,15.88 77.09,16.64 77.09,20.57 78.87,22.35 78.87,23.37 80.77,25.27 80.77,30.73 82.42,32.38 82.42,32.89 U$1.14/A0
IAT_SENSOR  (via drill 0.5)
  Top 0.305: v39.88,25.65 40.89,24.64 R41.1 C9.1 R40.1 | v29.84,27.3 29.08,27.3 28.19,28.32 28.19,29.46 v27.81,29.84 | v27.05,50.29 27.05,50.42 27.56,50.93 v32,50.93
  Bottom 0.305: v39.88,25.65 39.75,25.65 39.37,25.27 31.75,25.27 29.72,27.3 | 29.72,27.3 v29.84,27.3 | v27.81,29.84 27.81,37.21 27.18,37.72 27.18,50.16 v27.05,50.29 | v32,50.93 31.62,51.31 31.62,71.5 31.24,71.88 CON1.12 | 29.08,27.3 29.72,27.3
IDLE
  Top 1.676: 14.48,64.98 U$5.D 14.35,65.11 14.35,66.93
  Top 1.778: CON1.16 20.07,72.64 14.35,66.93
IDLE_CPU  (via drill 0.5)
  Top 0.305: v80.26,53.09 v80.26,50.67 | R16.2 8.89,43.25 U$15.4 8.89,47.24 9.14,47.5 22.48,47.5 22.86,47.88 50.04,47.88 50.8,48.64 50.8,49.02 v50.55,49.28
  Bottom 0.305: v80.26,50.67 80.39,50.42 81.28,49.53 86.23,49.53 86.61,49.91 93.34,49.91 93.98,49.28 93.98,47.12 95.76,45.34 95.76,34.04 96.52,33.27 96.52,32.64 97.41,31.75 98.55,31.75 99.82,30.48 99.82,19.81 U$1.5 | v80.26,53.09 79.76,52.58 78.36,52.58 76.71,50.93 62.99,50.93 61.09,49.02 53.59,49.02 52.7,49.91 51.31,49.91 50.67,49.28 v50.55,49.28
IDLE_TC4
  Top 0.305: U$5.G R38.1 R9.2
IGN1  (via drill 0.5)
  Top 0.61: R68.2 v28.07,40.77
  Bottom 0.61: CON1.33 24.26,72.52 24.77,72.01 25.65,72.01 28.07,69.47 v28.07,40.77
IGN1_CPU  (via drill 0.5)
  Top 0.305: U$9.2 31.56,32.13 R66.1 31.56,29.02 v32.51,28.07 | v75.56,46.35 75.69,46.35 76.96,47.62 76.96,54.99 80.14,58.17 80.14,61.34 81.66,62.87 84.84,62.87 85.34,63.37 98.81,63.37 100.33,61.85 100.33,55.88 U$1.29
  Bottom 0.305: v32.51,28.07 32.51,29.72 34.67,31.88 46.1,31.88 47.24,33.02 49.15,33.02 49.66,32.51 51.82,32.51 60.2,40.89 72.9,40.89 75.95,43.94 75.95,45.97 v75.56,46.35
IGN2  (via drill 0.5)
  Top 0.61: v38.73,34.8 R67.2
  Bottom 0.61: CON1.32 27.05,72.14 29.08,70.1 29.08,38.86 31.24,36.7 36.83,36.7 v38.73,34.8 38.61,34.67
IGN2_CPU  (via drill 0.5)
  Top 0.305: U$9.4 34.23,32.13 R63.2 34.23,29.91 v35.18,30.86 | v76.83,46.1 77.47,46.74 77.47,54.74 80.64,57.91 80.64,61.09 81.92,62.36 85.09,62.36 85.6,62.87 98.55,62.87 99.82,61.59 99.82,57.91 U$1.30
  Bottom 0.305: v76.83,46.1 76.45,45.72 76.45,44.7 76.71,44.45 76.71,43.94 73.15,40.39 60.45,40.39 52.07,32 49.4,32 48.9,32.51 47.5,32.51 46.35,31.37 35.69,31.37 v35.18,30.86
IGN3  (via drill 0.5)
  Top 0.61: R36.2 41.02,38.23 v40.89,38.35
  Bottom 0.61: v40.89,38.35 40.26,38.35 39.5,37.59 31.75,37.59 29.97,39.37 29.97,70.74 28.45,72.26 CON1.13
IGN3_CPU  (via drill 0.5, 0.5 pad 1.02)
  Top 0.305: U$11.2 44.38,32.13 R34.1 44.38,28 v44.07,27.69 | v77.47,44.96 77.98,45.47 77.98,54.36 81.15,57.53 81.15,59.18 81.66,59.69 83.31,59.69 85.85,62.23 98.42,62.23 99.31,61.34 99.31,59.94 U$1.31/A12
  Bottom 0.305: v77.47,44.96 77.22,44.7 77.22,43.69 73.41,39.88 60.71,39.88 52.32,31.5 49.15,31.5 48.64,32 47.75,32 44.07,28.32 v44.07,27.69
IGN4  (via drill 0.5)
  Top 0.61: R35.2 45.34,39.25 v44.58,40.01
  Bottom 0.61: v44.58,40.01 44.32,40.01 44.2,40.13 33.15,40.13 30.86,42.42 30.86,71.25 29.84,72.26 CON1.31
IGN4_CPU  (via drill 0.5)
  Top 0.305: U$11.4 47.06,32.13 R33.2 47.06,30.67 47.12,30.73 47.88,30.73 v48.13,30.99 | v78.11,43.81 78.49,44.2 78.49,53.98 81.66,57.15 83.82,57.15 84.84,58.17 84.84,60.33 86.11,61.59 97.16,61.59 U$1.32/A13
  Bottom 0.305: v48.13,30.99 52.58,30.99 60.96,39.37 73.66,39.37 v78.11,43.81
INJ1_CPU  (via drill 0.5)
  Top 0.305: 51.82,48.77 v51.94,48.9 50.42,47.37 23.24,47.37 22.86,46.99 U$14.2 22.86,43.25 R1.2
  Bottom 0.305: v51.94,48.9 52.32,48.9 52.7,48.51 61.34,48.51 63.25,50.42 76.96,50.42 78.61,52.07 80.52,52.07 81.15,52.7 81.15,53.98 81.79,54.61 83.44,54.61 86.87,51.18 95.12,51.18 96.77,49.53 98.55,49.53 99.19,48.9 99.19,31.88 100.33,30.73 100.33,12.7 U$1.2
INJ1_TC4
  Top 0.305: U$12.G R3.1 R58.2
INJ2_CPU  (via drill 0.5)
  Top 0.305: R4.2 25.4,43.25 U$14.4 25.4,46.48 25.78,46.86 35.94,46.86 v36.45,46.35
  Bottom 0.305: U$1.10/CS 97.66,30.48 95.89,32.26 95.89,33.02 95.25,33.66 95.25,45.09 93.34,46.99 81.92,46.99 81.15,47.75 81.15,48.51 80.26,49.4 63.75,49.4 61.85,47.5 49.78,47.5 49.4,47.12 43.18,47.12 42.42,46.35 v36.45,46.35
INJ2_TC4
  Top 0.305: 28.7,57.93 U$4.G R5.1 R39.2
INJ3_CPU  (via drill 0.5 pad 1.02)
  Top 0.305: U$7.2 v38.99,44.2 38.1,43.31 R7.2
  Bottom 0.305: U$1.6 99.31,21.84 99.31,28.45 98.55,29.21 96.77,29.21 96.52,29.46 96.52,30.86 95.38,32 95.38,32.77 94.74,33.4 94.74,44.83 93.09,46.48 84.58,46.48 83.95,45.85 83.95,44.96 83.44,44.45 81.53,44.45 81.28,44.7 81.28,46.74 80.64,47.37 80.64,48.26 80.01,48.9 64.01,48.9 62.1,46.99 50.04,46.99 49.66,46.61 43.43,46.61 41.02,44.2 v38.99,44.2
INJ3_TC4
  Top 0.305: U$6.G R8.1 R6.2
INJ4_CPU  (via drill 0.5)
  Top 0.305: U$7.4 41.53,44.2 | R10.2 41.53,43.37 41.53,44.2 | 41.53,44.2 42.29,44.2 v42.8,44.7 | v84.96,45.21 83.19,46.99 80.14,46.99 v79.88,46.74
  Bottom 0.305: v79.88,46.74 79.88,48.13 79.63,48.39 64.26,48.39 62.36,46.48 50.42,46.48 50.04,46.1 44.07,46.1 42.8,44.83 v42.8,44.7 | v84.96,45.21 85.09,45.21 85.98,45.97 92.84,45.97 94.23,44.58 94.23,33.15 94.74,32.64 94.74,31.88 95.89,30.73 95.89,28.96 96.9,27.94 U$1.9/CS
INJ4_TC4
  Top 0.305: R2.2 45.72,55.31 | 45.72,55.31 R11.1 | U$8.G 45.22,55.81 45.72,55.31
INJECTOR1
  Top 1.778: CON1.15 U$12.D 22.35,65.24 22.35,65.66
INJECTOR2
  Top 1.778: U$4.D 31.24,64.98 31.24,66.04 30.86,66.42 | 30.35,67.18 30.35,66.93 30.86,66.42 | CON1.14 25.65,70.61 29.97,66.29 30.73,66.29 30.86,66.42
INJECTOR3
  Top 1.778: CON1.9 39.62,66.8 | 39.62,66.8 39.62,65.24 U$6.D | 38.48,67.06 39.37,67.06 39.62,66.8
INJECTOR4
  Top 1.778: CON1.6 48.01,67.31 | 48.01,67.31 48.01,65.24 U$8.D | 46.86,66.93 47.62,66.93 48.01,67.31
LC1  (via drill 0.5)
  Top 0.61: Q1.3 76.83,67.06 76.45,67.44 76.45,68.83 v75.18,70.1
  Bottom 0.61: v75.18,70.1 75.18,69.72 74.8,69.34 60.33,69.34 59.18,70.48 CON1.2
MAP_CONV  (via drill 0.5, 0.5 pad 1.02)
  Top 0.305: R45.2 59.56,4.83 | 59.56,4.83 C18.2 | R31.2 74.3,5.97 v73.03,4.7 | 59.56,4.83 59.69,4.95 60.83,4.95 63.75,7.87 v66.55,7.87
  Bottom 0.305: v66.55,7.87 69.85,7.87 v73.03,4.7
MAP_CPU  (via drill 0.6)
  Top 0.305: 74.55,9.84 v74.55,11.05
  Top 0.406: 74.55,9.84 IC4.4 IC4.3
  Bottom 0.305: U$1.17/A3 83.95,24 83.95,22.23 83.31,21.59 79.63,21.59 78.11,20.07 78.11,18.67 78.61,18.16 79.76,18.16 81.03,16.89 81.03,12.06 80.14,11.18 74.68,11.18 v74.55,11.05
N$1
  Top 0.305: U$10.4 73.47,24.7 73.15,24.38 73.15,20.32 JMP1.1
N$2
  Top 0.305: JMP1.3 69.85,20.57 68.96,19.68 68.96,17.08 R53.2
N$3
  Top 0.508: U$9.5 34.86,37.4 R67.1
  Top 0.61: 35.94,35.69 R67.1
N$4
  Top 0.305: U$10.5 73.47,25.34 73.15,25.65 73.15,29.59 JMP2.3
N$5
  Top 0.508: U$9.7 31.62,36.2 30.73,35.31 28.58,35.31 R68.1
N$6
  Top 0.508: U$11.5 48.32,37.4 R35.1
N$7
  Top 0.305: JMP2.1 69.85,29.34 69.09,30.1 69.09,32.58 R54.1
N$8
  Top 0.508: U$11.7 44.45,35.81 43.05,34.42 41.79,34.42 R36.1
N$9
  Top 0.305: R62.1 79.44,61.4 81.41,63.37 84.58,63.37 85.09,63.88 87.5,63.88 87.88,64.26 87.88,67.69 86.87,68.71 86.36,68.71 85.72,69.34 85.72,70.23 86.36,70.87 87.38,70.87 87.63,70.61 U$19.5
N$10
  Top 0.305: U$7.5 45.65,50.86 47.37,52.58 R2.1
N$11  (via drill 0.5)
  Top 0.305: R69.1 89.03,74.55 v89.66,73.91 | v86.74,69.85 86.74,69.72 88.39,68.07 U$19.7
  Bottom 0.305: v89.66,73.91 89.66,71.75 87.5,69.6 87,69.6 v86.74,69.85
N$12
  Top 0.305: U1.8 73.91,35.94 74.68,36.7 74.68,41.34 R22.1
N$13  (via drill 0.5 pad 0.61)
  other vias: 20.95,11.43
N$14
  Top 0.406: STEPSTICK-X.SLP STEPSTICK-X.RST
N$15  (via drill 0.5 pad 0.61)
  other vias: 20.95,13.97
N$16  (via drill 0.5 pad 0.61)
  other vias: 20.95,16.51
N$17  (via drill 0.5 pad 0.61)
  other vias: 18.41,16.51
N$18  (via drill 0.5 pad 0.61)
  other vias: 18.41,13.97
N$19
  Top 0.61: C4.1 23.05,37.15 22.73,36.83
  Top 1.27: 18.73,32.69 C6.+ | L2.1 15.88,31.75 16.89,32.77 C6.+ | C6.+ 19.18,32.77 22.73,36.32 22.73,36.83 STEPSTICK-X.VMOT
N$20  (via drill 0.5 pad 0.61)
  other vias: 18.41,11.43
N$21  (via drill 0.5 pad 0.61)
  other vias: 15.88,11.43
N$22  (via drill 0.5 pad 0.61)
  other vias: 15.88,13.97
N$23  (via drill 0.5 pad 0.61)
  other vias: 15.88,16.51
N$24  (via drill 0.5 pad 0.61)
  other vias: 13.21,16.51
N$25
  Top 0.406: IC4.1 77.3,5.97 | 77.3,5.97 R31.1 | 77.3,5.97 77.3,3.68 R30.2
N$26  (via drill 0.5 pad 0.61)
  other vias: 13.21,13.97
N$27
  Top 0.406: R46.1 48.83,7.17 48.51,7.49 C19.1 R47.2 47.5,10.1 49.15,10.1 R48.1
N$28  (via drill 0.5)
  Top 0.305: R54.2 71.88,32.64 | 71.88,32.64 R55.2 | SJ5.2 56.39,31.24 v57.15,30.48 | v71.88,31.37 71.88,32.64
  Bottom 0.305: v57.15,30.48 71.12,30.48 71.88,31.24 v71.88,31.37
N$31  (via drill 0.5 pad 0.61)
  other vias: 13.34,11.43
N$32  (via drill 0.5, 0.6)
  Top 0.305: C17.2 R45.1 59.63,8 v61.98,8 | PS1.4 66.93,3.94 v66.67,4.19
  Bottom 0.305: v66.67,4.19 63.88,4.19 62.99,5.08 62.99,6.99 v61.98,8
N$33  (via drill 0.5 pad 0.61)
  other vias: 13.21,19.05
N$34  (via drill 0.5)
  Top 0.305: R53.1 71.75,17.02 | 71.75,17.02 R52.2 | SJ6.2 56.64,18.54 v57.15,19.05 | v71.63,18.29 71.63,17.14 71.75,17.02
  Bottom 0.305: v57.15,19.05 70.87,19.05 v71.63,18.29
N$35
  Top 0.305: R57.1 65.47,32.89 66.17,32.89 67.31,31.75 C25.2 67.37,28.96 68.07,28.96 69.32,27.71 U$10.9
N$36
  Top 0.305: R60.1 65.21,17.02 66.04,17.02 67.06,18.03 C26.1 67.12,20.95 67.94,20.95 69.32,22.33 U$10.16
N$37
  Top 0.305: R59.1 C26.2 67.57,23.43 U$10.15
N$38
  Top 0.305: 65.92,26.61 R28.1 C25.1 67.82,26.61 U$10.10
N$41
  Top 0.305: R25.1 R60.2
N$42
  Top 0.305: R27.2 61.15,32.83 SJ3.2
N$43  (via drill 0.5 pad 0.61)
  other vias: 15.75,19.05
N$44  (via drill 0.5 pad 0.61)
  other vias: 18.29,19.05
N$45  (via drill 0.5 pad 0.61)
  other vias: 20.95,19.05
N$48
  Top 0.203: 61.15,16.96 SJ4.2
  Top 0.305: 61.15,16.96 R25.2
N$49
  Top 0.305: R65.2 78.96,28.89 LED7.C
N$50
  Top 0.305: R64.2 78.83,20.89 LED6.C
N$51
  Top 0.406: D16.A L1.1
N$52
  Top 0.305: R6.1 U$7.7
N$53
  Top 0.305: U$15.5 8.96,50.93 12.7,50.93 14.48,52.7 R9.1
N$54
  Top 0.813: R23.1 LED5.A
N$55
  Top 0.305: R59.2 R26.1
N$56
  Top 0.305: R27.1 R57.2
N$57
  Top 0.305: R56.1 R28.2
N$60
  Top 0.305: U$15.7 R12.1
N$61
  Top 0.305: U$16.5 58.04,49.66 58.55,49.15 61.85,49.15 63.63,50.93 R13.1
N$62
  Top 0.305: R39.1 30.99,53.28 30.99,52.58 30.35,51.94 27.18,51.94 26.09,50.86 U$14.5
N$63
  Top 0.305: U$16.7 R14.1
N$64
  Top 0.305: R58.1 U$14.7
N$91
  Top 0.305: Q1.1 80.33,66.11 81.03,65.41 R72.1 82.23,66.61 82.8,67.18 83.57,67.18 83.95,67.56 83.95,68.9 R73.1
N$130
  Top 0.406: 15.32,2.29 D3.C 16.1,2.35 L4.1
  Top 1.016: IC2.2 15.32,2.29
O2_2_CPU  (via drill 0.5)
  Top 0.305: C37.1 59.18,39.56 D17.C D15.A 62.81,39.49 R37.2 v62.99,37.97 | v79.76,42.29 80.26,42.29 81.15,43.18 U$1.21/DAC0
  Bottom 0.305: v79.76,42.29 79.25,41.78 76.83,41.78 73.91,38.86 63.88,38.86 v62.99,37.97
O2_2_SENSOR  (via drill 0.5)
  Top 0.305: C36.1 R37.1 69.66,41.21 70.74,42.29 70.74,47.88 69.22,49.4 68.58,49.4 65.28,52.7 v65.28,53.85
  Bottom 0.305: CON1.26 43.81,73.15 42.04,71.37 42.04,53.47 42.55,52.96 65.41,52.96 65.41,53.72 v65.28,53.85
O2_CPU  (via drill 0.5)
  Top 0.305: 88.58,22.41 R21.2 88.33,24.26 v87.25,24.26 | D2.C 88.27,20 | C2.1 88.58,17.71
  Top 0.406: 88.58,22.41 D2.C | 88.27,20 C2.1 | 88.58,17.71 D1.A
  Bottom 0.305: U$1.A22/DAC1 82.93,40.64 84.07,39.5 84.07,26.8 86.61,24.26 v87.25,24.26
O2_SENSOR  (via drill 0.5)
  Top 0.305: R21.1 90.48,25.4 | 90.48,25.4 C1.1 91.06,26.92 | v68.71,53.21 68.33,52.83 68.33,51.94 69.22,51.05 69.85,51.05 72.26,48.64 72.26,45.47 74.68,43.05 76.96,43.05 79.25,40.77 79.88,40.77 81.28,39.37 84.58,39.37 v85.72,40.51 | v91.44,25.65 90.74,25.65 90.48,25.4
  Bottom 0.305: v68.71,53.21 68.58,53.21 67.82,52.45 42.29,52.45 41.53,53.21 41.53,71.75 42.42,72.64 CON1.8 | v85.72,40.51 85.72,40.39 85.09,39.75 85.09,28.96 85.85,28.19 85.85,26.67 86.87,25.65 v91.44,25.65 91.57,25.65
RST_CPU
  Top 0.305: D13.A 92.14,41.28 R49.2 C21.1 88.96,41.02 87.76,41.02 87.63,41.15 87.63,42.8 87.38,43.05 87.38,45.34 85.09,47.62 U$1.RESET
RX
  Top 0.305: JP1.3 74.3,12.95 75.82,11.43 85.85,11.43 87.88,13.46 91.69,13.46 92.58,12.57 92.58,8 93.73,6.86 96.01,6.86 U$1.0/RX
STEP_1A
  Bottom 0.61: STEPSTICK-X.1A 10.03,67.56 14.35,71.88 14.99,71.88 15.88,72.77 CON1.36
STEP_1B
  Bottom 0.61: STEPSTICK-X.1B 12.57,39.62 11.05,41.15 11.05,67.18 14.73,70.87 16.38,70.87 17.27,71.75 CON1.17
STEP_2A
  Bottom 0.61: STEPSTICK-X.2A 15.11,38.61 12.06,41.66 12.06,66.8 14.99,69.72 17.65,69.72 18.67,70.74 CON1.35
STEP_2B
  Bottom 0.61: STEPSTICK-X.2B 17.65,38.23 13.08,42.8 13.08,66.55 15.37,68.83 18.29,68.83 21.46,72.01 CON1.34
STP  (via drill 0.5)
  Top 0.305: v74.93,44.96 74.68,45.21 74.68,46.74 75.18,47.24 75.82,47.24 76.45,47.88 76.45,51.56 v76.07,51.94
  Bottom 0.305: STEPSTICK-X.SPT 7.49,26.29 9.53,28.32 30.35,28.32 34.42,32.38 45.85,32.38 46.99,33.53 49.4,33.53 49.91,33.02 51.56,33.02 59.94,41.4 72.64,41.4 75.44,44.2 75.44,44.45 v74.93,44.96 | v76.07,51.94 76.96,51.94 80.9,55.88 U$1.35/A16
SUPP1
  Top 0.406: L3.1 L4.2 26.54,7.86 C8.+
  Top 0.61: IC2.4 18.72,8.64 25.65,8.64 25.65,8.69 L4.2
TPS_CPU  (via drill 0.5)
  Top 0.305: 90.68,35.18 D10.C | C14.1 90.61,33.98 | D9.A v91.82,34.16 90.8,34.16 | U$1.16/A2 82.68,27.94 83.95,26.67 85.72,26.67 86.49,27.43 86.49,28.45 v87.12,28.96
  Top 0.406: R44.2 90.68,35.18 | 90.68,31.68 C14.1 | 90.61,33.98 D10.C 90.8,34.16
  Bottom 0.305: v87.12,28.96 87.25,29.2 86.36,29.2 86.11,29.46 86.11,33.66 86.49,34.04 91.7,34.04 v91.82,34.16
TPS_SIGNAL  (via drill 0.5)
  Top 0.305: R44.1 C13.1 87.76,38.1 87.38,38.48 87.38,40.39 85.85,41.91 81.79,41.91 81.15,41.27 79.5,41.27 77.22,43.56 74.93,43.56 72.77,45.72 72.77,48.9 v69.72,51.94
  Bottom 0.305: v69.72,51.94 42.04,51.94 41.02,52.96 CON1.27
TX
  Top 0.305: JP1.4 81.03,13.46 81.53,13.97 91.95,13.97 93.09,12.83 93.09,8.26 93.98,7.37 97.54,7.37 U$1.1/TX
VIN  (via drill 1)
  Top 1.778: CON1.37 12.95,76.2 11.81,75.06 11.81,73.79 CON1.19
  Top 2.184: v4.06,19.81 5.71,19.81 7.37,21.46 9.78,21.46 9.78,19.94 L1.2
  Bottom 1.93: CON1.19 11.68,74.8 CON1.37
  Bottom 2.184: CON1.19 11.56,73.66 1.91,64.01 1.91,21.97 v4.06,19.81
VR1+  (via drill 0.5)
  Top 0.305: SJ4.1 59.44,18.67 | 59.44,18.67 R29.1 57.79,17.02 SJ6.1 | 59.44,18.67 59.44,18.92 57.66,20.7 55.5,20.7 54.99,21.21 54.99,23.88 55.5,24.38 55.5,25.65 54.99,26.16 54.99,27.56 54.1,28.45 52.7,28.45 52.2,28.96 52.2,35.81 v51.82,36.07
  Bottom 0.305: v51.82,36.07 51.18,36.07 45.47,41.78 33.91,41.78 32.51,43.18 32.51,49.15 33.02,49.66 33.02,51.82 32.64,52.2 CON1.30
VR1-  (via drill 0.5)
  Top 0.203: 63.06,22.74 R26.2
  Top 0.305: 63.06,22.74 R29.2 57.91,23.75 57.28,24.38 56.52,24.38 56.01,24.89 56.01,25.91 55.5,26.42 55.5,27.81 54.36,28.96 52.96,28.96 52.7,29.21 52.7,35.69 52.83,35.81 52.83,36.7 v52.07,37.47
  Bottom 0.305: v52.07,37.47 51.82,37.47 51.44,37.08 50.93,37.08 45.72,42.29 34.16,42.29 33.02,43.43 33.02,48.9 33.53,49.4 33.53,52.07 33.15,52.45 33.15,72.77 CON1.11
VR2+  (via drill 0.5)
  Top 0.305: SJ3.1 59.31,31.11 58.55,31.88 58.55,32.14 R32.2 SJ5.1 54.86,34.54 53.85,35.56 53.85,38.48 52.45,39.88 51.31,39.88 v51.18,40.01
  Bottom 0.305: v51.18,40.01 49.53,40.01 46.23,43.31 34.8,43.31 34.04,44.07 34.04,48.39 34.54,48.9 34.54,52.58 34.16,52.96 34.16,70.99 CON1.10
VR2-  (via drill 0.5)
  Top 0.305: R56.2 63.32,27.17 R32.1 56.9,27.17 54.61,29.46 53.34,29.46 53.21,29.59 53.21,35.43 53.34,35.56 53.34,37.72 52.2,38.86 v52.07,38.86
  Bottom 0.305: v52.07,38.86 49.91,38.86 45.97,42.8 34.42,42.8 33.53,43.69 33.53,48.64 34.04,49.15 34.04,52.32 33.66,52.7 33.66,71.25 35.43,73.03 35.43,74.17 36.45,75.18 37.21,75.18 CON1.28
(copper drawn outside any net)
  shapes: Bottom area x1, Top area x16

## Text on the board
tNames: HC3 | LC1 | BOOST | IDLE | INJ1 | INJ2 | INJ3 | INJ4 | HC2 | HC1 | HC4 | ECUTeen3.5 | Designed for SPEEDUINO firmware | SEASIDE CUSTOMS GARAGE @ 2018 | . | STEPPER DRIVER | IGN1 | IGN2 | IGN3 | IGN4 | . | HALL | | | VR | . | VR2 | HALL2 | STP | DIR | . | HALL1 | VR1 | | | HALL | VR | . | www.garage.seasidecustoms.com | rev.A | . | . | . | . | 20180306